# EasyEDA Pro project ProPrj_STM32 数控可调直流电源_2026-05-18.epro, board PCB1
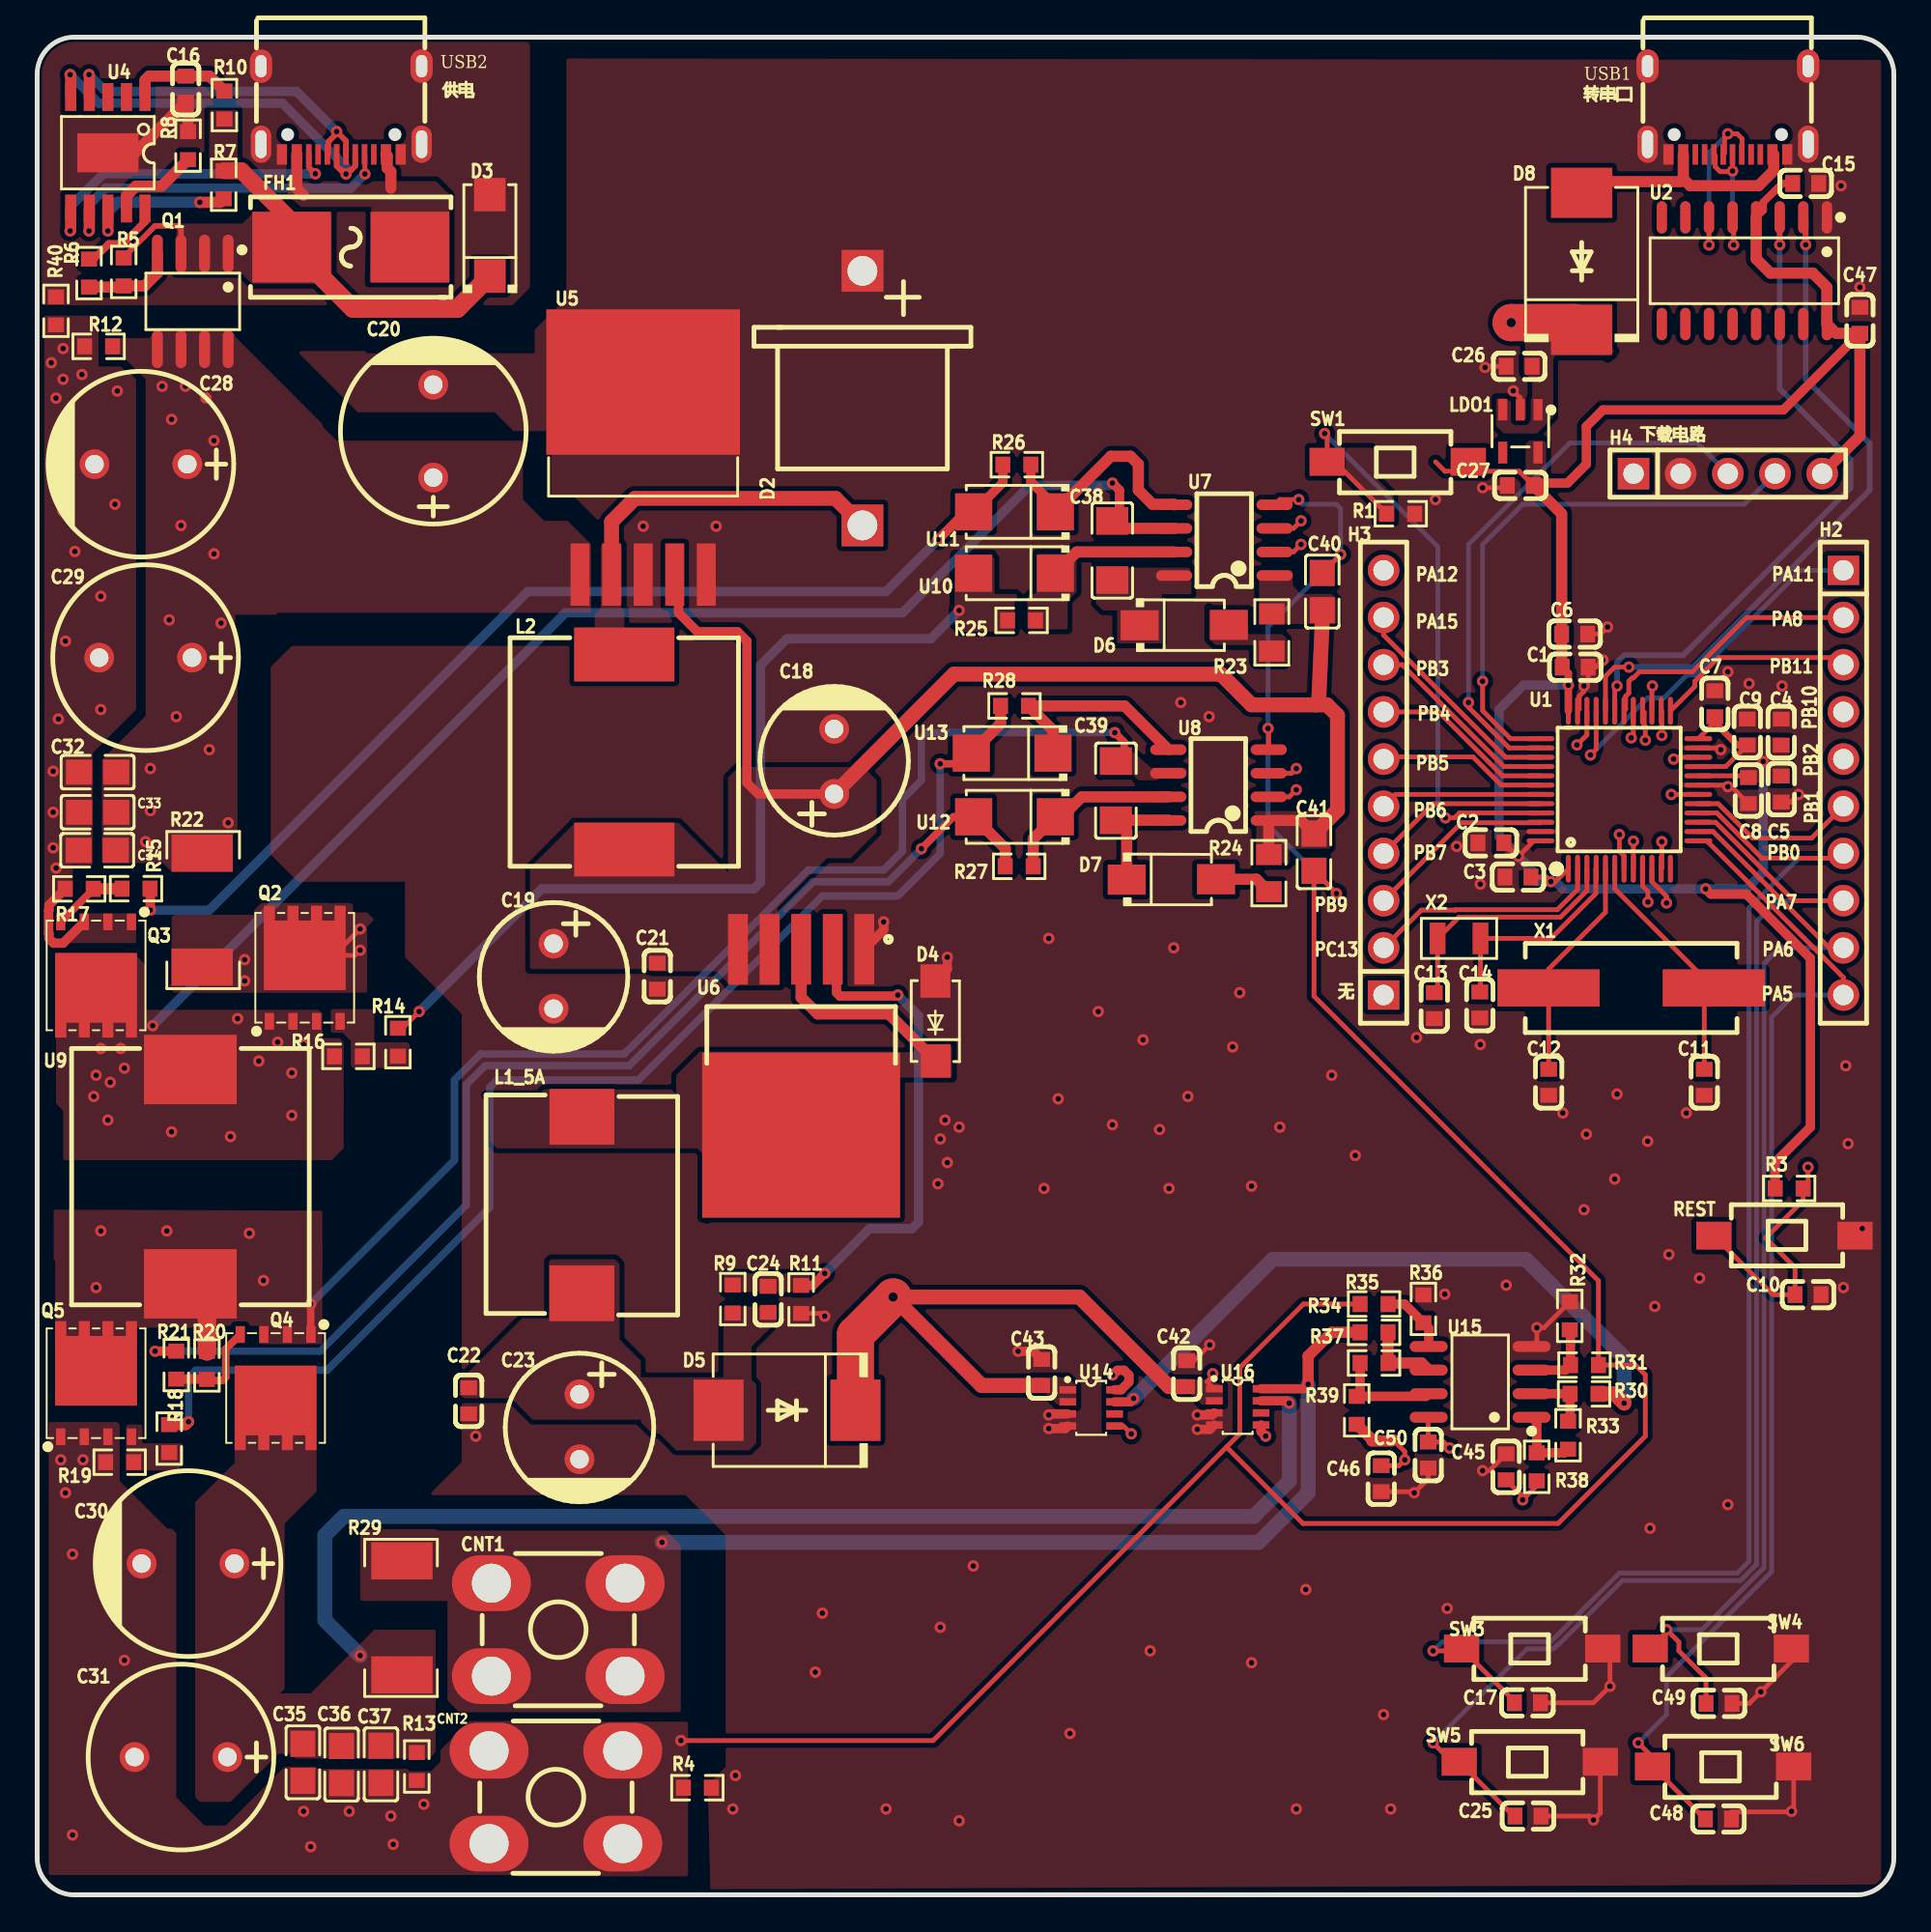
[diagram p2: board, top side]
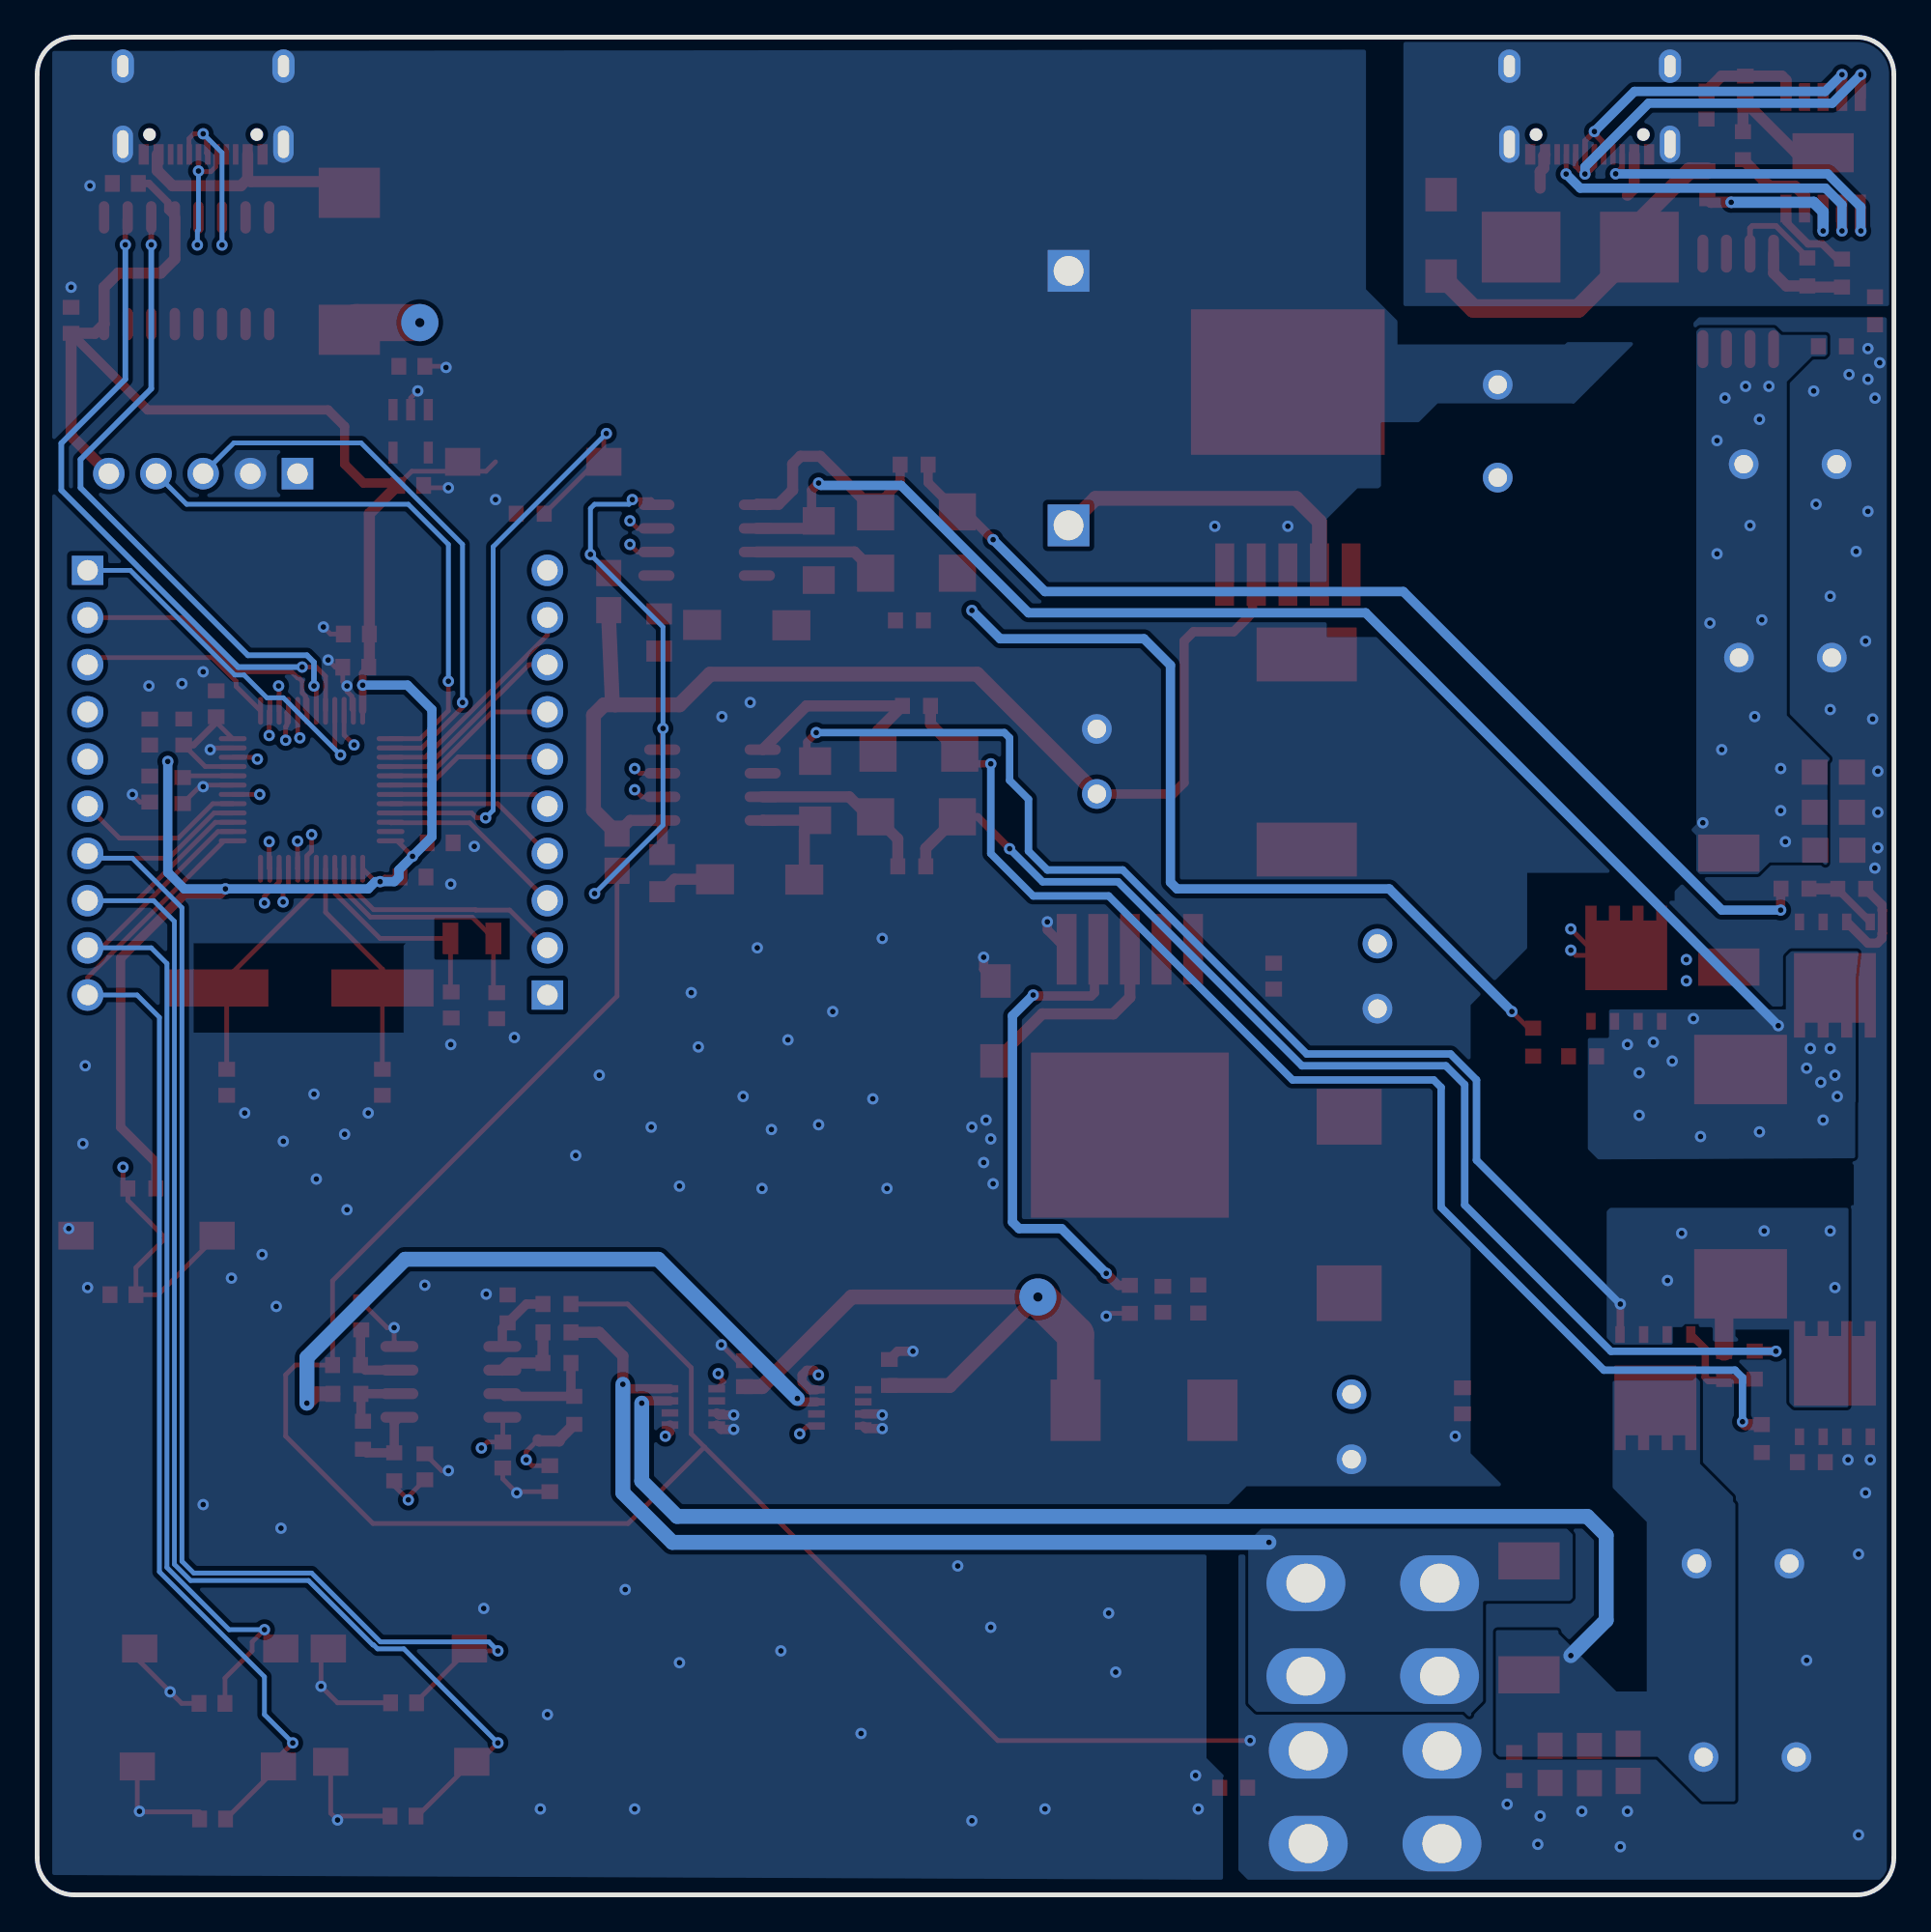
[diagram p3: board, bottom side, seen from below]

Outline 100 x 100 mm; copper layers: Top Layer, GND, POWER, Bottom Layer. Coordinates in mm from the lower left corner of the outline.
Outline path: 0,98 0,2 arc(0.59,0.59) 2,0 98,0 arc(99.41,0.59) 100,2 100,98 arc(99.41,99.41) 98,100 2,100 arc(0.59,99.41) 0,98
Stack: Top Layer 0.035mm Outer layer thickness 1oz / Dielectric1 0.2104mm 7628 RC49% 8.6mil / GND 0.0152mm Inner layer thickness / Dielectric2 1.065mm 1.1mm H/HOZ Copper / POWER 0.0152mm Inner layer thickness / Dielectric3 0.2104mm 7628 RC49% 8.6mil / Bottom Layer 0.035mm Outer layer thickness 1oz

## Design rules (mm)
spacing copperThickness1oz (default): track to track 0.12, other pairs 0.152 to 0.3
spacing copperThickness2oz: track to track 0.203, other pairs 0.152 to 0.3
track width copperThickness1oz (default): min 0.127, default 0.254, max 2.54
track width copperThickness2oz: min 0.203, default 0.254, max 2.54
differential pair differentialPair (default): width min 0.127, default 0.254, max 2.54; gap min 0.152, default 0.152

## Placement (name value [footprint] x y rotation side)
C1  100nF  [C0603]  82.84 66.08 180 top
C2  100nF  [C0603]  78.3 56.63 0 top
C3  100nF  [C0603]  79.76 54.79 0 top
C4  10nF  [C0603]  93.93 62.59 90 top
C5  1uF  [C0603]  93.94 59.52 270 top
C6  4.7uF  [C0603]  82.81 67.87 180 top
C7  100nF  [C0603]  90.36 64.11 270 top
C8  100nF  [C0603]  92.16 59.44 270 top
C9  1uF  [C0603]  92.11 62.59 90 top
C10  100nF  [C0603]  95.38 32.31 180 top
C11  30pF  [C0603]  89.79 43.74 90 top
C12  30pF  [C0603]  81.41 43.74 90 top
C13  15pF  [C0603]  75.25 47.86 90 top
C14  15pF  [C0603]  77.7 47.9 90 top
C15  100nF  [C0603]  95.25 92.13 180 top
C16  1uF  [C0603]  8 97.2 270 top
C17  10nF  [C0603]  80.26 10.34 0 top
C18  180uF  [CAP-TH_BD8.0-P3.50-D0.6-FD]  42.93 61.01 90 top
C19  220uF  [CAP-TH_BD8.0-P3.50-D0.5-FD]  27.81 49.45 270 top
C20  470uF  [CAP-TH_BD10.0-P5.00-D0.6-FD]  21.34 78.79 90 top
C21  1uF  [C0603]  33.4 49.45 270 top
C22  1uF  [C0603]  23.24 26.59 270 top
C23  330uF  [CAP-TH_BD8.0-P3.50-D0.5-FD]  29.21 25.2 270 top
C24  33nF  [C0603]  39.37 32.05 90 top
C25  10nF  [C0603]  80.3 4.24 0 top
C26  1uF  [C0603]  79.82 82.28 0 top
C27  1uF  [C0603]  79.88 75.87 0 top
C28  470uF  [CAP-TH_BD10.0-P5.00-D0.6-FD-A]  5.59 77.01 180 top
C29  220uF  [CAP-TH_BD10.0-P5.00-D0.6-FD_ERG50V220M10X13]  5.84 66.6 180 top
C30  470uF  [CAP-TH_BD10.0-P5.00-D0.6-FD-A]  8.13 17.83 180 top
C31  220uF  [CAP-TH_BD10.0-P5.00-D0.6-FD_ERG50V220M10X13]  7.75 7.42 180 top
C32  10uF  [C0805]  3.26 60.44 0 top
C33  10uF  [C0805]  3.26 58.28 0 top
C34  10uF  [C0805]  3.23 56.23 0 top
C35  10uF  [C0805]  14.31 7.13 90 top
C36  10uF  [C0805]  16.4 7.01 90 top
C37  10uF  [C0805]  18.52 7.02 90 top
C38  1uF  [C1206]  57.9 72.37 270 top
C39  1uF  [C1206]  58.1 59.44 270 top
C40  470nF  [C0805]  69.21 70.15 270 top
C41  470nF  [C0805]  68.77 56.13 90 top
C42  100nF  [C0603]  61.91 28.06 90 top
C43  100nF  [C0603]  54.1 28.12 90 top
C45  1nF  [C0603]  79.12 23.04 90 top
C46  1nF  [C0603]  72.39 22.4 270 top
C47  100nF  [C0603]  98.17 84.76 270 top
C48  10nF  [C0603]  90.55 4.08 0 top
C49  10nF  [C0603]  90.58 10.31 0 top
C50  100nF  [C0603]  74.92 23.68 270 top
CNT1  T34001  [CONN-TH_T34001]  28.07 14.27 90 top
CNT2  T34001  [CONN-TH_T34001]  27.94 5.26 90 top
D2  1N5825  [DIO-TH_BD11.4-L8.9-P13.7-RD]  44.45 80.57 90 top
D3  SMAJ24A  [SMA_L4.4-W2.6-LS5.0-RD]  24.38 89.33 90 top
D4  SS54  [SMA_L4.3-W2.6-LS5.0-FD]  48.39 47.04 270 top
D5  SS34  [SMC_L6.9-W5.9-LS7.9-RD]  40.39 26.09 180 top
D6  SS110  [SMA_L4.3-W2.6-LS5.0-RD]  61.78 68.35 0 top
D7  SS110  [SMA_L4.3-W2.6-LS5.0-RD]  61.09 54.66 0 top
D8  SS34  [SMC_L6.9-W5.9-LS7.9-RD]  83.18 87.93 90 top
FH1  XF-154  [FUSE-SMD_L10.5-W5.1]  16.89 88.7 180 top
H2  X5511FV-10-C70D30-1000  [HDR-TH_10P-P2.54-V-F]  97.28 59.87 270 top
H3  X5511FV-10-C70D30-1000  [HDR-TH_10P-P2.54-V-F]  72.52 59.87 90 top
H4  PZ254V-11-05P  [HDR-TH_5P-P2.54-V-M]  91.06 76.5 0 top
L1_5A  33uH  [IND-SMD_L11.5-W10.5]  29.34 37.13 90 top
L2  68uH  [IND-SMD_L12.3-W12.3_SMDRI127]  31.62 61.52 270 top
LDO1  ME6211C33M5G-N  [SOT-23-5_L3.0-W1.7-P0.95-LS2.8-BL]  79.88 78.79 180 top
Q1  AO4407A  [SOIC-8_L4.9-W3.9-P1.27-LS6.0-BL]  8.38 85.78 180 top
Q2  BSC027N06LS5ATMA1-MS  [TDSON-8_L5.9-W5.2-P1.27-BL-1]  14.41 48.8 0 top
Q3  BSC027N06LS5ATMA1-MS  [TDSON-8_L5.9-W5.2-P1.27-BL-1]  3.17 50.6 180 top
Q4  BSC027N06LS5ATMA1-MS  [TDSON-8_L5.9-W5.2-P1.27-BL-1]  12.84 28.39 180 top
Q5  BSC027N06LS5ATMA1-MS  [TDSON-8_L5.9-W5.2-P1.27-BL-1]  3.17 26.44 0 top
R1  10kΩ  [R0603]  73.44 74.35 180 top
R3  10kΩ  [R0603]  94.36 38.02 0 top
R4  0Ω  [R0603]  35.56 5.77 0 top
R5  10kΩ  [R0603]  4.66 87.36 270 top
R6  10kΩ  [R0603]  2.79 87.3 90 top
R7  10kΩ  [R0603]  10.05 92.05 270 top
R8  120kΩ  [R0603]  8.13 94.16 270 top
R9  16kΩ  [R0603]  37.46 32.07 270 top
R10  1kΩ  [R0603]  10.09 96.34 270 top
R11  3kΩ  [R0603]  41.15 32.05 90 top
R12  100kΩ  [R0603]  3.31 83.35 0 top
R13  10kΩ  [R0603]  20.45 6.91 90 top
R14  10Ω  [R0603]  19.43 45.9 270 top
R15  10Ω  [R0603]  5.33 54.16 180 top
R16  10kΩ  [R0603]  16.76 45.14 0 top
R17  10kΩ  [R0603]  2.27 54.15 0 top
R18  10Ω  [R0603]  7.11 24.56 270 top
R19  10kΩ  [R0603]  4.44 23.29 0 top
R20  10kΩ  [R0603]  9.14 28.5 270 top
R21  10Ω  [R0603]  7.49 28.52 90 top
R22  8mΩ  [RES-SMD_L6.4-W3.2-R2512]  8.89 53.01 270 top
R23  22Ω  [R0805]  66.5 67.95 90 top
R24  22Ω  [R0805]  66.34 55 90 top
R25  10Ω  [R0603]  53.02 68.6 180 top
R26  10Ω  [R0603]  52.77 76.99 180 top
R27  10Ω  [R0603]  52.89 55.36 180 top
R28  10Ω  [R0603]  52.64 64 180 top
R29  8mΩ  [RES-SMD_L6.4-W3.2-R2512]  19.65 14.91 90 top
R30  100kΩ  [R0603]  83.32 26.97 180 top
R31  100kΩ  [R0603]  83.34 28.52 180 top
R32  10kΩ  [R0603]  82.54 31.17 270 top
R33  10kΩ  [R0603]  82.45 24.74 90 top
R34  100kΩ  [R0603]  72 30.28 0 top
R35  100kΩ  [R0603]  72 31.8 0 top
R36  10kΩ  [R0603]  74.66 31.54 270 top
R37  10kΩ  [R0603]  72 28.63 0 top
R38  100Ω  [R0603]  80.77 23.04 270 top
R39  100Ω  [R0603]  71.07 26.08 270 top
R40  0Ω  [R0603]  1.02 85.27 270 top
REST  TS-1101-C-W  [SW-SMD_L6.0-W3.3-LS8.0]  94.11 35.48 180 top
SW1  TS-1101-C-W  [SW-SMD_L6.0-W3.3-LS8.0]  73.28 77.14 0 top
SW3  TS-1101-C-W  [SW-SMD_L6.0-W3.3-LS8.0]  80.52 13.26 0 top
SW4  TS-1101-C-W  [SW-SMD_L6.0-W3.3-LS8.0]  90.68 13.26 0 top
SW5  TS-1101-C-W  [SW-SMD_L6.0-W3.3-LS8.0]  80.39 7.16 0 top
SW6  TS-1101-C-W  [SW-SMD_L6.0-W3.3-LS8.0]  90.8 6.91 0 top
U1  STM32G474CBT6  [LQFP-48_L7.0-W7.0-P0.50-LS9.0-BL]  85.22 59.49 0 top
U2  CH340C  [SOP-16_L10.0-W3.9-P1.27-LS6.0-BL]  91.95 87.43 180 top
U4  CH224K  [ESSOP-10_L4.9-W3.9-P1.0-LS6.0-TL-EP]  3.81 93.78 180 top
U5  LM2596S-12/NOPB  [TO-263-5_L10.6-W9.6-P1.70-LS15.9-TL]  32.64 76.25 90 top
U6  XL4005E1  [TO-263-5_L10.2-W9.2-P1.70-TL]  41.15 45.9 270 top
U7  LM5109BMAX-JSM  [SOIC-8_L5.0-W4.0-P1.27-LS6.1-BL]  63.94 72.92 90 top
U8  LM5109BMAX-JSM  [SOIC-8_L5.0-W4.0-P1.27-LS6.1-BL]  63.63 59.74 90 top
U9  22uH  [IND-SMD_L13.8-W12.8]  8.25 38.66 270 top
U10  1N4007  [SMA_L4.3-W2.6-LS5.1-RD]  52.64 71.14 180 top
U11  1N4007  [SMA_L4.3-W2.6-LS5.1-RD]  52.64 74.45 180 top
U12  1N4007  [SMA_L4.3-W2.6-LS5.1-RD]  52.64 58.03 180 top
U13  1N4007  [SMA_L4.3-W2.6-LS5.1-RD]  52.51 61.46 180 top
U14  INA186A2IDDFR  [TSOT-23-8_L2.9-W1.6-P0.65-LS2.8-BL]  56.77 26.21 270 top
U15  GS8558-SR  [SOIC-8_L4.9-W3.8-P1.27-LS6.0-BL]  77.72 27.61 90 top
U16  INA186A2IDDFR  [TSOT-23-8_L2.9-W1.6-P0.65-LS2.8-BL]  64.66 26.27 270 top
USB1  TYPE-C 16PIN 2MD(073)  [USB-C-SMD_TYPE-C-6PIN-2MD-073]  91.06 96.06 180 top
USB2  TYPE-C 16PIN 2MD(073)  [USB-C-SMD_TYPE-C-6PIN-2MD-073]  16.38 96.06 180 top
X1  8MHz  [CRYSTAL-SMD_L11.5-W4.8-LS12.7]  85.85 48.82 0 top
X2  32.768kHz  [OSC-SMD_L3.2-W1.5]  76.58 51.49 0 top

## Footprints (pads in the part's own frame, mm; a bottom-side part is the same pattern mirrored in y, then rotated)
C0603
  rect 0.8x0.9 smd: 1(-0.7,0) 2(0.7,0)
C0805
  rect 1.41x1.35 smd: 1(-1,0) 2(1,0)
C1206
  rect 1.485x1.728 smd: 1(-1.593,0) 2(1.593,0)
CAP-TH_BD8.0-P3.50-D0.5-FD
  round 1.6 hole 1: 1(-1.75,0) 2(1.75,0)
CAP-TH_BD8.0-P3.50-D0.6-FD
  round 1.6 hole 1: 1(-1.75,0) 2(1.75,0)
CAP-TH_BD10.0-P5.00-D0.6-FD
  round 1.6 hole 1: 1(-2.5,0) 2(2.5,0)
CAP-TH_BD10.0-P5.00-D0.6-FD-A
  round 1.6 hole 1: 1(-2.5,0) 2(2.5,0)
CAP-TH_BD10.0-P5.00-D0.6-FD_ERG50V220M10X13
  round 1.6 hole 1: 1(-2.5,0) 2(2.5,0)
CONN-TH_T34001
  oval 3x4.25 hole 2.1: 1(-2.5,-3.6) 2(2.5,-3.6) 3(2.5,3.6) 4(-2.5,3.6)
CRYSTAL-SMD_L11.5-W4.8-LS12.7
  rect 5.5x2 smd: 1(-4.45,0) 2(4.45,0)
DIO-TH_BD11.4-L8.9-P13.7-RD
  rect 2.25x2.25 hole 1.6: 1(-6.85,0) 2(6.85,0)
ESSOP-10_L4.9-W3.9-P1.0-LS6.0-TL-EP
  rect 0.6x1.5 smd: 1(-2,-3) 2(-1,-3) 3(0,-3) 4(1,-3) 5(2,-3) 6(2,3) 7(1,3) 8(0,3) 9(-1,3) 10(-2,3)
  rect 3.3x2.1 smd: 11(0,0)
FUSE-SMD_L10.5-W5.1
  rect 4.24x3.81 smd: 1(-3.185,0) 2(3.185,0)
HDR-TH_5P-P2.54-V-M
  rect 1.7x1.7 hole 1.1: 1(-5.08,0)
  round 1.7 hole 1.1: 2(-2.54,0) 3(0,0) 4(2.54,0) 5(5.08,0)
HDR-TH_10P-P2.54-V-F
  rect 1.575x1.7 hole 1.1: 1(-11.43,0)
  round 1.7 hole 1.1: 2(-8.89,0) 3(-6.35,0) 4(-3.81,0) 5(-1.27,0) 6(1.27,0) 7(3.81,0) 8(6.35,0) 9(8.89,0) 10(11.43,0)
IND-SMD_L11.5-W10.5
  rect 3x3.5 smd: 1(-4.75,0) 2(4.75,0)
IND-SMD_L12.3-W12.3_SMDRI127
  rect 2.9x5.4 smd: 1(-5.25,0) 2(5.25,0)
IND-SMD_L13.8-W12.8
  rect 3.735x5 smd: 1(-5.768,0) 2(5.768,0)
LQFP-48_L7.0-W7.0-P0.50-LS9.0-BL
  oval 0.27x1.5 smd: 1(-2.75,-4.25) 2(-2.25,-4.25) 3(-1.75,-4.25) 4(-1.25,-4.25) 5(-0.75,-4.25) 6(-0.25,-4.25) 7(0.25,-4.25) 8(0.75,-4.25) 9(1.25,-4.25) 10(1.75,-4.25) 11(2.25,-4.25) 12(2.75,-4.25) 25(2.75,4.25) 26(2.25,4.25) 27(1.75,4.25) 28(1.25,4.25) 29(0.75,4.25) 30(0.25,4.25) 31(-0.25,4.25) 32(-0.75,4.25) 33(-1.25,4.25) 34(-1.75,4.25) 35(-2.25,4.25) 36(-2.75,4.25)
  oval 1.5x0.27 smd: 13(4.25,-2.75) 14(4.25,-2.25) 15(4.25,-1.75) 16(4.25,-1.25) 17(4.25,-0.75) 18(4.25,-0.25) 19(4.25,0.25) 20(4.25,0.75) 21(4.25,1.25) 22(4.25,1.75) 23(4.25,2.25) 24(4.25,2.75) 37(-4.25,2.75) 38(-4.25,2.25) 39(-4.25,1.75) 40(-4.25,1.25) 41(-4.25,0.75) 42(-4.25,0.25) 43(-4.25,-0.25) 44(-4.25,-0.75) 45(-4.25,-1.25) 46(-4.25,-1.75) 47(-4.25,-2.25) 48(-4.25,-2.75)
OSC-SMD_L3.2-W1.5
  rect 0.85x1.7 smd: 1(-1.155,0) 2(1.155,0)
R0603
  rect 0.806x0.864 smd: 1(-0.753,0) 2(0.753,0)
R0805
  rect 1.133x1.377 smd: 1(-1,0) 2(1,0)
RES-SMD_L6.4-W3.2-R2512
  rect 2x3.3 smd: 1(-3.067,0) 2(3.067,0)
SMA_L4.3-W2.6-LS5.0-FD
  rect 1.8x1.62 smd: 1(-2.15,-0.009) 2(2.15,0.009)
SMA_L4.3-W2.6-LS5.0-RD
  rect 2.046x1.62 smd: 1(-2.404,-0.009) 2(2.404,0.009)
SMA_L4.3-W2.6-LS5.1-RD
  rect 2x2 smd: 1(-2.2,0) 2(2.2,0)
SMA_L4.4-W2.6-LS5.0-RD
  rect 1.8x1.7 smd: 1(-2.192,0) 2(2.192,0)
SMC_L6.9-W5.9-LS7.9-RD
  rect 2.7x3.3 smd: 1(-3.687,0) 2(3.687,0)
SOIC-8_L4.9-W3.8-P1.27-LS6.0-BL
  oval 0.588x2.045 smd: 1(-1.905,-2.772) 2(-0.635,-2.772) 3(0.635,-2.772) 4(1.905,-2.772) 5(1.905,2.772) 6(0.635,2.772) 7(-0.635,2.772) 8(-1.905,2.772)
SOIC-8_L4.9-W3.9-P1.27-LS6.0-BL
  oval 0.588x2.045 smd: 1(-1.905,-2.57) 2(-0.635,-2.57) 3(0.635,-2.57) 4(1.905,-2.57) 5(1.905,2.57) 6(0.635,2.57) 7(-0.635,2.57) 8(-1.905,2.57)
SOIC-8_L5.0-W4.0-P1.27-LS6.1-BL
  oval 0.569x1.95 smd: 1(-1.905,-2.705) 2(-0.635,-2.705) 3(0.635,-2.705) 4(1.905,-2.705) 5(1.905,2.705) 6(0.635,2.705) 7(-0.635,2.705) 8(-1.905,2.705)
SOP-16_L10.0-W3.9-P1.27-LS6.0-BL
  oval 0.56x1.745 smd: 1(-4.445,-2.873) 2(-3.175,-2.873) 3(-1.905,-2.873) 4(-0.635,-2.873) 5(0.635,-2.873) 6(1.905,-2.873) 7(3.175,-2.873) 8(4.445,-2.873) 9(4.445,2.873) 10(3.175,2.873) 11(1.905,2.873) 12(0.635,2.873) 13(-0.635,2.873) 14(-1.905,2.873) 15(-3.175,2.873) 16(-4.445,2.873)
SOT-23-5_L3.0-W1.7-P0.95-LS2.8-BL
  rect 0.49x1.157 smd: 1(-0.95,-1.153) 2(0,-1.153) 3(0.95,-1.153)
  rect 0.49x1.175 smd: 4(0.95,1.153) 5(-0.95,1.153)
SW-SMD_L6.0-W3.3-LS8.0
  rect 1.9x1.5 smd: 1(-3.8,0) 2(3.8,0)
TDSON-8_L5.9-W5.2-P1.27-BL-1
  rect 0.5x0.9 smd: 1(-1.905,-1.775) 2(-0.635,-1.775) 3(0.635,-1.775) 4(1.905,-1.775)
  custom 4.41x4.55 smd: 5(0,1.775)
TO-263-5_L10.2-W9.2-P1.70-TL
  rect 3.8x1.069 smd: 1(-5.003,3.404) 2(-5.003,1.702) 3(-5.003,0) 4(-5.003,-1.702) 5(-5.003,-3.404)
  rect 8.89x10.66 smd: 6(5.003,0)
TO-263-5_L10.6-W9.6-P1.70-LS15.9-TL
  rect 3.358x1.02 smd: 1(-5.184,3.4) 2(-5.184,1.7) 3(-5.184,0) 4(-5.184,-1.7) 5(-5.184,-3.4)
  rect 7.83x10.431 smd: 6(5.183,0)
TSOT-23-8_L2.9-W1.6-P0.65-LS2.8-BL
  rect 0.4x0.9 smd: 1(-0.975,-1.26) 2(-0.325,-1.26) 3(0.325,-1.26) 4(0.975,-1.26) 5(0.975,1.26) 6(0.325,1.26) 7(-0.325,1.26) 8(-0.975,1.26)
USB-C-SMD_TYPE-C-6PIN-2MD-073
  rect 0.55x1.1 smd: 1(-3.2,2.375) 2(-2.4,2.375) 11(2.4,2.375) 12(3.2,2.375)
  rect 0.3x1.1 smd: 3(-1.75,2.375) 4(-1.25,2.375) 5(-0.75,2.375) 6(-0.25,2.375) 7(0.25,2.375) 8(0.75,2.375) 9(1.25,2.375) 10(1.75,2.375)
  oval 1.1x2 hole 0.6x1.5: 13(-4.325,1.825) 14(4.325,1.825)
  oval 1.2x1.8 hole 0.6x1.2: 13(-4.325,-2.375) 14(4.325,-2.375)

## Nets
As in the schematic.

Pads without a net: LDO1 4; U1 12; U2 7 8 9 10 11 12 13 14 15; U4 2 3; U14 6; U16 6; USB1 3 4 9 10; USB2 3 9

## Via types
v1: diameter 0.61, hole 0.305, Top Layer to Bottom Layer, 244 vias
v2: diameter 2, hole 0.5, Top Layer to Bottom Layer, 2 vias

## Routing (per net, layer and track width the routed paths; a pad name or vN(x,y) marks a point on that pad's centre or on a via; arc(x,y) is an arc through that point)
GND: length 57.5
  Top Layer w0.254: v1(90.68,61.65) 90.59,61.74 U1.23 ; C8.2 91.26,59.65 v1(91.06,59.65) 90.97,59.74 U1.19 ; R11.1 42.27,31.3 v1(42.42,31.15) ; v1(84.58,68.25) 84.2,67.87 C6.1 ; C5.2 94.46,58.82 v1(94.87,59.23) ; C46.2 74.11,21.7 v1(74.17,21.64) 74.92,22.39 C50.2 ; C25.2 83.61,4.24 v1(83.82,4.03) 84.19,4.4 84.19,7.16 ; v1(77.98,82.22) 78.04,82.28 C26.1 ; v1(63.15,29.61) 62.3,28.76 61.91,28.76 ; C17.2 83.82,10.34 v1(84.71,11.23) 84.71,12.87 SW3.2 ; C45.2 78.21,22.83 v1(77.85,22.83) ; v1(79.5,80.96) 79.88,80.57 LDO1.2 ; U1.35 83.05,63.82 83.05,64.52 83.31,64.78 v1(83.31,65.07) 83.54,65.3 C1.1 83.94,66.08 v1(84.33,66.47) ; SW4.2 94.48,12.57 v1(92.84,10.93) 92.22,10.31 C49.2 ; U15.4 80.77,29.8 v1(80.77,30.53) 81.15,30.53 R32.1 ; C27.1 79.06,75.74 v1(77.85,75.74) ; SW6.2 94.61,4.61 v1(94.49,4.5) 94.46,4.47 91.25,4.47
  Top Layer w0.5: v1(52.83,29.26) 53.66,29.26 C43.2 ; v1(62.48,25.06) 63.16,25.06 U16.4 ; U6.1 45.59,51.94 v1(45.59,52.37) ; U14.4 55.37,25.1 v1(54.48,25.1) ; 63.4,25.94 63.29,25.83 v1(62.48,25.83) ; D4.1 49.02,49.84 v1(49.02,50.47) ; U14.3 54.54,25.89 v1(54.48,25.83)
  vias: v1(23.62,24.69) v1(32.64,73.67) v1(36.57,73.67) v1(37.46,4.62) v1(37.61,6.43) v1(41.91,11.99) v1(42.29,15.16) v1(45.72,4.62) v1(48.51,38.28) v1(48.64,40.69) v1(48.64,14.4) v1(48.89,41.71) v1(49.02,39.42) v1(49.66,41.33) v1(49.66,3.99) v1(50.42,17.7) v1(54.23,38.02) v1(54.48,51.49) v1(54.99,42.85) v1(55.63,8.69) v1(57.15,47.55) v1(57.91,41.45) v1(59.56,46.02) v1(59.94,13.13) v1(60.45,41.2) v1(60.96,38.02) v1(61.21,50.98) v1(61.59,64.19) v1(61.98,42.98) v1(63.12,63.42) v1(64.39,45.64) v1(64.77,48.56) v1(65.4,38.15) v1(65.4,12.5) v1(66.93,41.33) v1(67.82,4.62) v1(68.33,16.43) v1(69.72,44.12) v1(70.99,39.8) v1(72.52,9.7) v1(72.9,4.62) v1(74.3,46.15) v1(75.31,75.11) v1(75.81,32.34) v1(75.95,15.42) v1(76.45,56.44) v1(77.72,54.41) v1(77.72,45.77) v1(79.12,32.82) v1(82.17,42.09) v1(83.31,36.88) v1(83.44,40.94) v1(84.96,38.53) v1(85.09,43.1) v1(86.74,40.56) v1(86.87,19.74) v1(87.12,31.67) v1(87.88,34.47) v1(88.82,42.09) v1(89.53,33.2) v1(91.06,65.84) v1(91.06,21.01) v1(92.2,65.2) v1(93.98,65.07) v1(97.15,92) v1(97.28,32.69) v1(97.41,44.63) v1(97.54,40.44) v1(98.17,86.54) v1(98.3,35.86)
PGND: length 151.2
  Top Layer w0.254: v1(70.2,72.16) 70.2,72.14 C40.1 ; R35.1 68.2,31.8 64.77,28.37 64.77,24.82 64.06,24.1 ; v1(69.98,53.9) 69.98,53.92 C41.1 68.77,48.38 84.09,33.05 R31.1 86.09,28.52 86.61,27.99 86.61,24.69 81.92,19.99 68.17,19.99 64.06,24.1 ; U8.4 66.33,62.75 v1(66.29,62.79) ; v1(34.67,8.31) 48.26,8.31 64.06,24.1 ; v1(67.94,75.11) 66.93,75.11 66.65,74.83
  Top Layer w0.5: 1.52,54.15 0.63,53.27 0.63,53.01 0.62,52.99 0.62,51.76 0.63,51.74 0.63,51.49 0.89,51.23 1.4,51.23 Q3.3
  Bottom Layer w0.254: v1(67.94,75.11) 67.94,75.03 68.12,74.85 69.98,74.85 70.2,74.63 v1(70.2,72.16) 66.29,68.25 v1(66.29,62.79) 66.29,57.58 v1(69.98,53.9)
  vias: v1(0.76,82.47) v1(0.86,60.48) v1(0.86,58.28) v1(0.86,56.36) v1(1.02,80.57) v1(1.02,55.27) v1(1.14,63.3) v1(1.27,23.42) v1(1.4,83.24) v1(1.4,81.58) v1(1.4,74.47) v1(1.52,67.49) v1(1.52,21.64) v1(1.9,18.34) v1(1.9,3.23) v1(2.03,72.31) v1(2.41,81.84) v1(2.47,23.42) v1(3.43,69.9) v1(3.43,63.8) v1(4.19,74.85) v1(4.32,80.95) v1(4.7,12.62) v1(14.35,4.5) v1(14.73,2.59) v1(16.81,4.5) v1(19.05,4.24) v1(19.18,2.72) v1(20.83,4.88)
VBUS: length 24.2
  Top Layer w0.3: R5.1 4.66,88.15 6.35,89.84 7.62,89.84 7.75,89.71 Q1.3
  Top Layer w0.9: R7.1 11,92.81 13.71,90.1 FH1.2
  Top Layer w1: D3.1 22.64,85.39 17.01,85.39 FH1.2
VCC5: length 137.9
  Top Layer w0.254: U16.1 63.01,27.63 63.32,27.94 v1(63.32,28.06) ; v1(76.07,24.05) 75.75,24.38 C50.1 74.92,25.68 U15.8
  Top Layer w0.8: 54.1,27.42 50.86,27.42 v2(46.1,32.18) 56.13,32.18 60.96,27.36 C42.1
  Top Layer w2: D5.1 44.07,30.15 v2(46.1,32.18) ; v2(79.39,84.63) 82.8,84.63 D8.1
  POWER w0.254: v1(63.32,28.06) 63.32,25.89 65.15,24.05 v1(76.07,24.05)
  POWER w2: v2(79.39,84.63) 56.26,84.63 51.69,80.06 51.69,37.77 v2(46.1,32.18)
VCC12: length 66.2
  Top Layer w0.5: U5.4 34.54,70.86 34.54,69.01 35.56,68 37.72,68 38.23,67.49 38.23,59.87 38.83,59.26 C18.1
  Top Layer w0.6: R24.2 66.33,56.01 U8.1 68.06,57.84 C41.2
  Top Layer w0.8: 68.87,64.06 65.4,64.06 63.75,65.71 49.37,65.71 C18.1 ; 68.87,64.06 69.02,64.21 69.23,69.05 ; 68.87,64.06 69.47,64.06 70.03,63.49 70.03,58.39 C41.2
VCC20: length 115.4
  Top Layer w0.5: v1(59.05,26.72) 58.87,26.54 U14.7
  Top Layer w0.8: 84.07,26.97 84.97,26.97 v1(85.47,26.47)
  POWER w0.8: v1(10.29,57.71) 18.03,57.71 22.22,53.52 22.22,30.77 22.79,30.21 59.8,30.21 60.36,29.64 60.36,28.84 59.05,27.53 v1(59.05,26.72)
  Bottom Layer w0.8: v1(59.05,26.72) 66.55,34.21 80.18,34.21 85.47,28.92 v1(85.47,26.47)
  vias: v1(5.84,56.69) v1(6.1,60.63) v1(6.1,58.36) v1(6.73,81.2) v1(7.11,68.63) v1(7.24,79.43) v1(7.49,63.42) v1(7.75,73.71) v1(7.99,81.2) v1(9.1,80.58) v1(9.27,61.65) v1(9.52,78.28) v1(9.52,72.19) v1(9.91,68.46)
VCC20_PWR: length 72.6
  Top Layer w0.254: 15.98,50.57 v1(17.4,51.99) ; 15.98,50.57 17.12,50.57 v1(17.4,50.85) ; 15.98,50.57 Q2.5
  Top Layer w0.5: v1(57.92,27.98) 58.17,28.24 58.54,28.24 58.8,27.98 58.8,27.61 58.38,27.19 U14.8
  POWER w0.8: v1(11.18,49.2) 17.53,49.2 20.78,45.95 20.78,29.69 22.1,28.37 57.53,28.37 v1(57.92,27.98)
  vias: v1(11.18,50.34)
VCC33: length 131
  Top Layer w0.254: 75.31,77.14 75.82,76.63 79.82,76.63 C27.2 ; U1.21 90.95,60.74 C9.1 ; U1.20 92.07,60.24 C8.1 ; C3.2 81.28,54.79 v1(81.53,54.54) 81.77,54.54 U1.1 ; U1.48 80.61,56.74 v1(79.78,55.9) 79.72,55.9 79,56.63 ; 90.36,63.13 U1.24
  Top Layer w0.35: C9.1 91.57,61.89 90.36,63.11 C7.2
  Top Layer w0.4: U1.36 v1(82.47,65.12) 82.47,65.76 C1.2 ; U2.4 92.96,90.68 92.96,91.11 93.98,92.13 C15.2
  Top Layer w0.5: R3.1 93.61,39.43 95.5,41.33 95.5,50.41 92.05,53.87 90.14,53.87 v1(89.86,54.15) ; C27.2 80.71,76 82.42,76 83.44,77.01 83.44,79.04 84.33,79.93 94.05,79.93 C47.2
  Top Layer w0.6: C1.2 82.11,66.12 82.11,74.35 C27.2 ; H4.5 98.17,78.54 C47.2 96.89,84.06 U2.16 96.39,86.54 95.63,87.3 93.34,87.3 92.58,88.06 U2.4
  Bottom Layer w0.5: v1(82.47,65.12) 80.05,65.12 78.74,63.8 78.74,56.95 v1(79.78,55.9) 80.52,55.17 80.52,54.79 80.77,54.54 81.78,54.54 82.17,54.15 v1(89.86,54.15) 92.08,54.15 92.96,55.04 v1(92.96,61.01)
VIN-: length 7
  Top Layer w0.6: U4.11 5.27,93.78 C16.2 8.13,96.38 R8.1
ADC_I_OUT: length 62
  Top Layer w0.254: v1(86.75,53.45) 86.75,54.01 86.47,54.3 U1.9
  Top Layer w0.5: v1(66.17,24.69) 65.92,24.94 U16.5
  POWER w0.254: v1(86.75,53.45) 86.88,53.45 87.52,52.81 91.72,52.81 93.81,50.72 93.81,28.94 89.55,24.69 v1(66.17,24.69)
ADC_I_PWR: length 70.1
  Top Layer w0.254: U14.5 58.51,25.24 v1(58.93,24.82) ; v1(85.97,56.72) 85.97,55.24 U1.8
  POWER w0.254: v1(85.97,56.72) 85.98,56.71 85.98,53.39 86.97,52.4 91.56,52.4 93.4,50.56 93.4,32.62 89.66,28.88 62.99,28.88 v1(58.93,24.82)
ADC_V_IN: length 54
  Top Layer w0.254: C45.1 80.01,21.45 v1(80.01,21.26) 80.77,22.02 R38.2 ; U1.11 87.5,55.27 v1(87.5,56.69)
  POWER w0.254: v1(87.5,56.69) 89.15,56.69 94.61,51.23 94.61,28.5 87.38,21.26 v1(80.01,21.26)
ADC_V_OUT: length 59.9
  Top Layer w0.254: 73.02,24.5 73.66,23.86 v1(73.66,23.42) 73.34,23.1 C46.1 ; v1(87.76,53.39) 87.76,53.75 86.97,54.54 U1.10
  Top Layer w0.6: 73.02,24.5 72.95,24.44 71.88,24.44 71.88,24.52 R39.2
  POWER w0.254: v1(73.66,23.42) 88.96,23.42 94.21,28.67 94.21,51.06 91.88,53.39 v1(87.76,53.39)
CH224K_CC1: length 19.2
  Top Layer w0.254: v1(17.65,92.63) 17.65,93.67 USB2.4
  Top Layer w0.6: v1(2.79,89.57) 2.81,89.59 U4.7
  Bottom Layer w0.5: v1(17.65,92.63) 16.89,91.87 3.68,91.87 2.79,90.98 v1(2.79,89.57)
CH224K_CC2: length 17.6
  Top Layer w0.3: USB2.10 14.63,92.99 v1(14.98,92.64)
  Top Layer w0.6: v1(1.78,89.57) 1.81,89.6 U4.6
  Bottom Layer w0.5: v1(14.98,92.64) 3.57,92.64 1.78,90.86 v1(1.78,89.57)
CH224K_DM: length 21.1
  Top Layer w0.3: USB2.7 16.13,93.06 16.36,92.84 16.43,92.84 v1(16.64,92.63) 16.84,92.84 16.91,92.84 17.13,93.06 USB2.5
  Top Layer w0.6: v1(1.78,97.98) 1.81,97.95 U4.5
  Bottom Layer w0.5: v1(1.78,97.98) 3.32,96.44 13.21,96.44 16.64,93.01 v1(16.64,92.63)
CH224K_DP: length 18.7
  Top Layer w0.3: USB2.8 15.68,93.74 15.68,94.36 16.13,94.81 v1(16.13,94.92) 16.63,94.42 USB2.6
  Top Layer w0.6: v1(2.79,97.98) 2.81,97.97 U4.4
  Bottom Layer w0.5: v1(2.79,97.98) 3.7,97.08 13.97,97.08 v1(16.13,94.92)
CH224K_PG: length 4.6
  Top Layer w0.4: U4.10 5.81,90.06 4.62,88.87 3.86,88.87 3.04,88.05 R6.2
CH340C_RXD: length 35.3
  Top Layer w0.254: v1(85.09,65.07) 84.97,64.95 U1.31
  Top Layer w0.3: U2.3 v1(93.85,88.82)
  Bottom Layer w0.3: v1(85.09,65.07) 85.09,66.34 85.47,66.73 88.65,66.73 97.66,75.74 97.66,77.27 93.85,81.08 v1(93.85,88.82)
CH340C_TXD: length 36.4
  Top Layer w0.254: v1(85.72,66.09) 84.96,66.09 84.47,65.59 U1.32
  Top Layer w0.3: U2.2 95.25,90.17 v1(95.25,88.82)
  Bottom Layer w0.3: v1(95.25,88.82) 95.25,81.58 98.7,78.14 98.7,75.62 89.17,66.09 v1(85.72,66.09)
D+: length 8.2
  Top Layer w0.254: USB1.6 91.31,93.69 v1(91.31,92.79) 91.28,92.76 90.64,92.76 90.38,93.02 90.38,93.62 USB1.8 ; U2.5 91.37,90.24 v1(91.37,88.81)
  Bottom Layer w0.254: v1(91.37,88.81) 91.37,89.56 91.31,89.62 91.31,92.79 v1(91.31,92.79)
D-: length 10.8
  Top Layer w0.254: USB1.5 91.82,93.7 91.82,94.54 91.56,94.8 v1(91.06,94.8) 90.88,94.62 90.88,93.76 USB1.7 ; v1(90.04,88.81) U2.6
  Bottom Layer w0.254: v1(91.06,94.8) 90.04,93.78 v1(90.04,88.81)
JTCK/SWCLK: length 30.5
  Top Layer w0.254: U1.38 79.28,61.74 77.09,63.93 v1(77.09,64.19)
  Bottom Layer w0.254: H4.3 89.41,78.16 82.55,78.16 77.09,72.69 v1(77.09,64.19)
JTMS/SWDIO: length 30
  Top Layer w0.254: v1(77.85,65.33) 77.85,63.74 79.36,62.24 U1.37
  Bottom Layer w0.254: H4.4 91.95,74.85 80.01,74.85 77.85,72.69 v1(77.85,65.33)
MCU_PWM_H1: length 27.7
  Top Layer w0.254: 66.65,72.29 67.66,72.29 v1(68.07,72.69) ; U1.26 87.5,63.7 v1(87.5,62.41)
  POWER w0.254: v1(87.5,62.41) 87.19,62.41 86.86,62.74 86.5,62.74 83.02,66.22 81.03,66.22 73.28,73.96 71.12,73.96 69.85,72.69 v1(68.07,72.69)
MCU_PWM_H2: length 38.3
  Top Layer w0.254: v1(67.82,59.49) 67.44,59.11 U8.2 ; U1.28 86.55,63.65 86.55,62.95 86.61,62.89 v1(86.61,62.15)
  POWER w0.254: v1(67.82,59.49) 71.37,63.04 71.37,72.82 71.55,73 72.85,73 84.15,61.7 86.09,61.7 86.55,62.15 v1(86.61,62.15)
MCU_PWM_L1: length 27.1
  Top Layer w0.254: v1(68.07,73.96) 67.66,73.56 66.65,73.56 ; U1.27 86.97,65.05 v1(86.99,65.07)
  POWER w0.254: v1(68.07,73.96) 68.48,74.37 73.51,74.37 80.39,67.49 86.61,67.49 86.79,67.31 86.79,65.28 v1(86.99,65.07)
MCU_PWM_L2: length 36.6
  Top Layer w0.254: U1.29 85.97,62.4 v1(85.85,62.28) ; U8.3 67.56,60.38 v1(67.82,60.63)
  POWER w0.254: v1(85.85,62.28) 84.33,62.28 73.15,73.46 71.25,73.46 70.87,73.08 70.87,63.68 v1(67.82,60.63)
MOS_PWM_H1: length 46.4
  Top Layer w0.254: R14.1 19.68,46.65 v1(20.57,47.55)
  Bottom Layer w0.5: v1(20.57,47.55) 27.18,54.15 38.61,54.15 38.96,54.51 38.96,66.19 40.39,67.61 48.13,67.61 v1(49.66,69.14)
MOS_PWM_H2: length 64.3
  Top Layer w0.4: U12.2 49.34,58.03 v1(47.62,56.31)
  Top Layer w0.5: R21.2 6.36,29.27 v1(6.35,29.26)
  Top Layer w0.6: R27.2 52.14,56.33 U12.2
  Bottom Layer w0.4: v1(47.62,56.31) 45.85,54.53 41.78,54.53 31.88,44.63 24.13,44.63 23.11,43.61 23.11,37.13 15.24,29.26 v1(6.35,29.26)
MOS_PWM_L1: length 57.6
  Top Layer w0.5: v1(6.1,53.01) 6.1,54.14 R15.1 ; 52.01,76.99 52.01,76.02 U11.2 50.01,74.45 v1(48.51,72.95)
  Bottom Layer w0.5: v1(48.51,72.95) 45.72,70.15 26.42,70.15 9.27,53.01 v1(6.1,53.01)
MOS_PWM_L2: length 69.4
  Top Layer w0.4: v1(48.64,60.88) 49.74,60.88 U13.2
  Top Layer w0.6: R28.2 51.89,63.03 U13.2 ; v1(8.15,25.47) 8,25.32 R18.1
  Bottom Layer w0.4: v1(48.64,60.88) 48.64,56.06 46.36,53.77 42.29,53.77 32.39,43.87 24.78,43.87 24.38,43.47 24.38,37.01 15.62,28.25 8.55,28.25 8.15,27.84 v1(8.15,25.47)
PA5: length 63.8
  Top Layer w0.254: 89.85,4.08 89.83,4.08 SW6.1 87,7.41 v1(86.23,8.18) ; H2.10 97.28,49.38 89.93,56.74 U1.13
  Bottom Layer w0.254: v1(86.23,8.18) 87.76,9.7 87.76,11.73 93.41,17.39 93.41,47.24 94.61,48.44 H2.10
PA6: length 60.4
  Top Layer w0.254: U1.14 90.26,57.24 96.52,50.98 H2.9 ; 86.89,13.27 87.76,14.14 v1(87.76,14.27) 88.42,13.61 88.42,13.13 89.88,11.67 C49.1
  Bottom Layer w0.254: H2.9 93.85,50.98 93.01,50.13 93.01,17.62 89.66,14.27 v1(87.76,14.27)
PA7: length 76.8
  Top Layer w0.254: U1.15 90.4,57.74 94.61,53.52 97.28,53.52 ; 79.59,4.24 79.51,4.24 SW5.1 76.2,7.16 v1(75.18,8.18)
  Bottom Layer w0.254: 97.28,53.52 93.73,53.52 92.61,52.4 92.61,17.79 91.73,16.92 85.38,16.92 81.92,13.45 81.87,13.45 81.67,13.24 80.25,13.24 v1(75.18,8.18)
PA8: length 14.7
  Top Layer w0.254: H2.2 92.08,68.76 89.15,65.84 86.3,65.84 85.97,65.51 85.9,65.51 85.72,65.33 85.72,64.7 85.55,64.52 85.55,63.82 U1.30
PA11: length 20.2
  Top Layer w0.254: v1(83.66,61.36) 83.97,61.67 U1.33
  Bottom Layer w0.254: 97.28,71.3 94.98,71.3 89.35,65.66 88.85,65.66 87.63,64.44 86.74,64.44 v1(83.66,61.36)
PA12: length 16.4
  Top Layer w0.254: v1(82.93,61.9) 83.47,62.44 U1.34
  POWER w0.254: v1(82.93,61.9) 73.53,71.3 72.52,71.3
PA15: length 12.1
  Top Layer w0.254: H3.9 72.52,67.81 79.09,61.24 U1.39
PB0: length 75.2
  Top Layer w0.254: SW3.1 76.84,13.13 ; 76.84,13.13 79.56,10.41 C17.1 ; 76.84,13.13 v1(75.18,13.13) ; H2.7 97.03,55.8 92.9,55.8 90.47,58.24 U1.16
  Bottom Layer w0.254: H2.7 97.03,55.8 94.87,55.8 92.2,53.14 92.2,17.96 91.57,17.32 85.22,17.32 81.51,13.62 75.67,13.62 v1(75.18,13.13)
PB1: length 9.3
  Top Layer w0.254: U1.17 90.54,58.74 92.39,56.88 95.57,56.88 97.28,58.6
PB2: length 11.9
  Top Layer w0.254: U1.18 88.02,59.24 v1(88.01,59.23)
  POWER w0.254: H2.5 95.25,61.14 92.84,58.72 91.06,58.72 90.55,59.23 v1(88.01,59.23)
PB3: length 10.7
  Top Layer w0.254: H3.8 73.51,66.22 78.99,60.74 U1.40
PB4: length 9.9
  Top Layer w0.254: U1.41 78.92,60.24 75.48,63.68 H3.7
PB5: length 9.1
  Top Layer w0.254: U1.42 80.96,59.74 78.85,59.74 77.33,61.25 72.63,61.25 H3.6
PB6: length 8.7
  Top Layer w0.254: 72.52,58.6 73.16,59.24 U1.43
PB7: length 9.6
  Top Layer w0.254: H3.4 75.2,58.74 U1.44
PB8-BOOT0: length 34.6
  Top Layer w0.254: U1.45 76.6,58.24 76.34,57.97 v1(75.85,57.97) ; v1(69.34,78.66) 69.48,78.53 SW1.1 69.89,77.14 R1.2
  Bottom Layer w0.254: v1(75.85,57.97) 75.44,58.38 75.44,72.57 v1(69.34,78.66)
PB9: length 10.2
  Top Layer w0.254: U1.46 80.94,57.71 76.71,57.71 72.52,53.52
PB10: length 11.6
  Top Layer w0.254: U1.22 88.24,61.24 v1(88.14,61.14)
  POWER w0.254: v1(88.14,61.14) 88.39,61.14 90.93,63.68 H2.4
PB11: length 10.8
  Top Layer w0.254: H2.3 96.9,66.6 90.55,66.6 89.28,65.33 89.28,65.05 U1.25
PC13: length 12.9
  Top Layer w0.254: H3.2 74.55,53.01 76.38,53.01 76.4,53.03 81.87,53.03 82.97,54.13 U1.2
PC14-OSC32_IN: length 13.3
  Top Layer w0.254: U1.3 83.47,54.05 82.04,52.63 76.57,52.63 X2.1 75.43,48.74 C13.2
PC15-OSC32_OUT: length 11.5
  Top Layer w0.254: C14.2 77.74,48.64 X2.2 81.53,51.49 83.95,53.9 83.95,55.22 U1.4
PF0-OSC_IN: length 12.1
  Top Layer w0.254: U1.5 84.47,52.89 81.4,49.83 X1.1 81.41,48.81 C12.2
PF1-OSC_OUT: length 13.2
  Top Layer w0.254: U1.6 84.97,54.15 X1.2 89.79,48.31 C11.2
PG10-NRST: length 62.9
  Top Layer w0.254: U1.7 85.47,55.94 85.22,56.19 v1(85.22,57.07) ; v1(95.38,39.17) 95.38,38.29 R3.2 95.11,37.38 93.09,35.36 94.68,33.77 C10.2 93.48,32.31 REST.2
  POWER w0.254: 85.47,57.33 89.09,57.33 95.02,51.4 95.02,39.52 v1(95.38,39.17) ; 85.47,57.33 v1(85.22,57.07) ; 85.47,57.33 87.25,59.11 87.25,61.26 89.15,63.17 89.15,73.33 H4.1
SW1: length 69.6
  Top Layer w0.5: v1(57.91,76) 58.29,75.62 58.29,74.35 C38.1
  Top Layer w0.6: C38.1 58.31,73.56 U7.6
  Bottom Layer w0.5: v1(57.91,76) 57.78,75.87 53.47,75.87 46.61,69.01 28.45,69.01 v1(6.22,46.79)
  vias: v1(3.05,42.98) v1(3.17,44.12) v1(3.43,45.56) v1(3.81,41.71) v1(3.94,43.74) v1(4.5,45.56) v1(4.7,44.5) v1(7.24,41.07) v1(10.41,40.82) v1(10.79,47.17) v1(11.94,44.88) v1(12.95,45.9) v1(13.72,44.25) v1(13.72,41.96) v1(14.35,45.77)
SW2: length 69.1
  Top Layer w0.4: v1(14.73,31.8) 14.73,30.18 Q4.1 ; v1(58.04,62.56) 58.55,62.06 58.55,61.48 C39.1
  Top Layer w1: R20.1 9.14,32 U9.2
  Bottom Layer w0.4: v1(58.04,62.56) 47.91,62.56 47.62,62.28 47.62,59.99 46.61,58.98 46.61,56.18 45.59,55.17 41.53,55.17 31.62,45.26 23.88,45.26 22.48,43.87 22.48,39.55 v1(14.73,31.8)
  vias: v1(3.17,32.69) v1(3.43,35.74) v1(6.98,35.74) v1(11.43,35.61) v1(12.19,33.07)
VOUT+: length 49.2
  Top Layer w0.5: U16.8 68.21,27.24 v1(68.45,27.48)
  Top Layer w0.6: v1(68.45,27.48) 68.45,29.01 69.73,30.28 R34.1
  Bottom Layer w0.8: v1(33.65,18.97) 65.79,18.97 68.45,21.64 v1(68.45,27.48)
VOUT_FINAL: length 66.2
  Top Layer w0.5: U16.7 67.31,26.59 v1(67.44,26.47)
  Bottom Layer w0.8: v1(67.44,26.47) 67.44,22.28 65.53,20.37 16.51,20.37 15.49,19.35 15.49,14.78 v1(17.4,12.88)
XL4005E1_FB: length 26.2
  Top Layer w0.5: R11.2 41.77,32.81 v1(42.42,33.45) ; v1(46.36,48.44) 46.3,48.39 43.23,48.39 43.05,48.56 43.05,50.7 U6.2
  Bottom Layer w0.5: v1(46.36,48.44) 47.47,47.32 47.47,36.22 47.12,35.86 44.83,35.86 v1(42.42,33.45)
$1N8: length 4.3
  Top Layer w0.6: 18.78,93.69 18.86,93.61 18.86,92.95 19.05,92.76 19.05,91.87 ; 14.35,91.49 13.98,91.86 USB2.11
$1N11: length 5
  Top Layer w0.6: R6.1 4.6,86.55 R5.2 5.79,86.61 6.48,87.3 Q1.4
$1N18: length 8.8
  Top Layer w0.6: R7.2 9.86,91.11 v1(8.76,91.11) ; U4.8 v1(3.81,89.57)
  Bottom Layer w0.6: v1(3.81,89.57) 3.81,90.6 4.32,91.11 v1(8.76,91.11)
$1N27: length 5.6
  Top Layer w0.6: U4.1 5.81,97.68 6.03,97.9 C16.1 9.28,97.9 R10.1
$1N38: length 4.8
  Top Layer w0.6: R8.2 6.7,91.98 5.32,91.98 4.81,91.47 U4.9
$1N43: length 17.5
  Top Layer w0.8: D2.1 43,75.17 32.19,75.17 30.94,73.92 U5.2
$1N50: length 11.3
  Top Layer w0.6: U6.3 41.15,48.31 42.04,47.42 45.87,47.42 D4.2
$1N72: length 4.1
  Top Layer w0.4: R17.2 3.02,54.12 Q3.4
  Top Layer w0.6: R15.2 4.56,54.15 R17.2
$1N81: length 5.4
  Top Layer w0.4: Q4.4 10.16,29.38 10.16,27.86 9.98,27.68 9.2,27.68 R20.2
  Top Layer w0.5: 9.13,27.76 R21.1
$1N89: length 6.9
  Top Layer w0.6: U7.7 55.98,72.29 U10.1
$1N90: length 12.6
  Top Layer w0.5: U11.1 54.84,74.74 53.52,76.06 R26.1
  Top Layer w0.6: U7.5 61.21,74.85 60.07,74.85 59.31,75.62 59.31,77.01 58.88,77.44 57.83,77.44 U11.1
$1N97: length 11.6
  Top Layer w0.6: U8.5 58.57,64 R28.1 54.71,62.68 U13.1
$1N100: length 6.3
  Top Layer w0.6: D7.1 58.68,57.26 C39.2 60.91,57.85 U8.8
$1N101: length 3.1
  Top Layer w0.6: R24.1 65.67,54.67 D7.2
$1N105: length 9.7
  Top Layer w0.6: U8.7 56.26,59.11 55.19,58.03 U12.1 53.65,56.84 R27.1
$1N139: length 3.6
  Top Layer w0.5: U15.2 82.55,26.98 R30.2 82.56,25.61 R33.2
$1N140: length 4.1
  Top Layer w0.5: R32.2 82.58,30.38 R31.2 82.31,28.25 U15.3
$1N144: length 3.8
  Top Layer w0.5: R33.1 82.26,23.79 R38.1 80.77,25.43 U15.1
$1N147: length 3.7
  Top Layer w0.5: R35.2 73.65,31.8 R36.2 74.95,30.5 U15.5
$1N149: length 4
  Top Layer w0.6: R34.2 R37.2 74.57,28.63 U15.6
$1N150: length 5.8
  Top Layer w0.5: R37.1 71.25,27.01 R39.1 74.8,26.83 U15.7
$2N73: length 13.3
  Top Layer w0.6: D8.2 83.78,92.22 88.49,92.22 88.65,92.38 ; 88.65,92.38 89.03,92 92.71,92 93.53,92.82 93.53,93.69 ; 88.65,92.38 88.66,92.39 USB1.11

## Copper pours and planes (outline as drawn; the poured copper is in the pictures)
GND on Top Layer: 23.85,48.89 34.62,49.2 35.05,49.2 35.05,46.02 24.51,46.02 24.13,45.64 24.13,48.61
GND on Top Layer: 28.5,85.95 28.5,98.85 99.31,98.78 99.31,0.56 36.26,0.3 36.11,5.92 37.08,6.89 37.08,19.35 34.92,21.51 21.08,21.51 22.86,23.29 22.86,47.42 19.81,50.47 19.81,54.53 14.05,54.53 12.57,56.01 12.57,66.09 13.72,67.23 30.61,67.23 30.61,73.58 28.96,75.23 27.81,75.23 27.69,75.36 27.69,78.79 25.65,78.79 24.64,79.81 17.4,79.81 17.27,79.68 17.27,79.81 13.97,83.11 17.65,83.11 17.78,82.98 26.8,82.98 26.8,84.25
GND on Bottom Layer: 36.05,6.4 37.02,7.37 37.02,19.83 34.86,21.99 21.02,21.99 22.8,23.77 22.8,47.9 19.75,50.95 19.75,55.01 13.98,55.01 12.51,56.49 12.51,66.57 13.65,67.71 30.54,67.71 30.54,74.06 28.89,75.71 27.75,75.71 27.62,75.84 27.62,79.27 25.59,79.27 24.57,80.28 17.34,80.28 17.21,80.16 17.21,80.28 13.91,83.59 17.59,83.59 17.72,83.46 26.73,83.46 26.73,84.73 28.43,86.43 28.43,99.33 99.19,99.25 99.19,1.07 36.13,0.81 36.13,6.31
GND on GND: 0.26,99.74 99.74,99.74 99.74,0.26 0.26,0.26
PGND on Top Layer: 0.25,85.01 3.17,85.01 3.3,84.89 3.3,82.27 4.51,82.27 4.83,81.95 4.96,81.95 5.33,81.58 5.33,63.8 3,61.47 3,55.51 2.92,55.42 1.92,55.42 1.92,53.79 1.9,53.77 1.27,53.77 1.2,53.84 1.2,53.77 1.13,53.77 0.63,53.27 0.38,53.27 0.38,84.89
PGND on Top Layer: 2.29,52.83 5.26,52.83 5.33,52.76 5.33,51.23 1.4,51.23 2.16,51.99 2.16,52.25 2.29,52.38
PGND on Top Layer: 0.51,25.45 4.32,25.45 4.44,25.32 4.44,22.28 4.47,22.3 4.47,22.25 7.01,19.71 7.26,19.71 7.49,19.48 7.49,5.26 9.02,3.73 10.16,3.73 13.33,6.91 14.99,6.91 15.11,6.78 19.94,6.78 20.07,6.66 21.21,6.66 21.72,7.16 21.72,7.8 23.28,9.36 28.41,9.36 28.45,9.32 35.05,9.32 35.05,1 25.85,1 25.78,1.07 0.62,1.07 0.62,25.34
PGND on Bottom Layer: 10.5,84.92 10.79,84.63 10.79,55.3 10.67,55.17 11.81,54.03 11.81,53.52 16.76,53.52 17.14,53.14 17.14,20.12 17.4,19.86 34.04,19.86 35.31,18.59 35.31,1.32 34.8,0.81 0.76,0.81 0.38,1.19 0.38,84.92
VBUS on Top Layer: 7.49,89.84 7.62,89.97 11.05,89.97 11.68,90.6 15.88,90.6 15.88,86.78 15.75,86.65 15.69,86.72 11.58,86.72 10.99,87.3 7.5,87.3 7.49,87.3
VBUS on Top Layer: 9.27,92.4 9.27,96.08 10.8,96.08 10.8,92.77 10.43,92.4
VCC5 on Top Layer: 61.34,27.74 63.02,27.74 63.88,27.41 63.88,26.37 62.74,26.37 62.14,26.97 61.34,26.97 61.34,26.98
VCC5 on Top Layer: 53.59,27.86 55.52,27.86 55.97,27.41 55.97,26.29 55.04,26.29 54.29,27.04 53.7,27.04 53.64,27.1 53.59,27.1
VCC5 on Top Layer: 81.53,79.43 81.41,79.43 81.41,79.3 80.78,78.66 78.99,78.66 78.58,79.08 78.58,80.57 79.37,80.57 79.37,79.3 79.5,79.17 80.26,79.17 80.44,79.35 80.44,80.57 80.52,80.57 80.52,81.51 80.06,81.98 80.06,82.78 80.14,82.85 80.14,85.39 80.39,85.65 84.71,85.65 84.84,85.52 84.84,83.24 84.96,83.11 84.58,82.73 84.58,82.85 81.79,82.85 81.66,82.73 81.66,79.55
VCC12 on Top Layer: 65.66,55.55 65.66,58.09 65.4,58.34 69.35,58.34 69.67,58.03 69.67,56.38 69.6,56.31 67.44,56.31 67.44,55.55 67.31,55.42 67.18,55.55
VCC12 on Top Layer: 65.81,68.45 65.81,71.15 65.66,71.3 67.63,71.3 67.63,70.47 68.07,70.03 69.72,70.03 69.98,69.77 69.98,68.34 69.92,68.4 65.86,68.4
VCC12 on Top Layer: 39.88,53.14 39.88,52.76 40.01,52.76 40.01,48.95 37.34,48.95 36.58,49.71 33.15,49.71 33.02,49.83 26.55,49.83 26.55,55.3 28.96,57.71 34.54,57.71 37.21,55.04 37.21,60.15 37.77,60.71 44.5,60.71 45.21,59.99 45.21,57.2 43.81,55.8 42.55,55.8
VCC20 on Top Layer: 10.05,79.26 12.45,79.26 12.45,69.39 12.83,69.01 10.03,69.01 9.91,69.14 9.91,79.12
VCC20 on Top Layer: 11.43,79.04 10.67,79.04 10.67,66.73 10.79,66.6 10.79,57.33 10.54,57.07 10.54,55.04 7.27,55.04 6.77,55.54 3.49,55.54 3.49,61.11 5.84,63.46 5.84,81.58 4.47,82.95 3.78,82.95 3.68,82.85 3.68,83.8 6.03,83.8 6.48,84.25 10.36,84.25 10.67,83.95 10.67,83.87 15.37,79.17 15.37,79.04 16.13,78.28 26.16,78.28 26.16,75.11 27.3,73.96 28.57,73.96 29.84,72.69 29.84,69.1 29.76,69.01 12.19,69.01 11.43,69.77
VCC20 on Bottom Layer: 4.51,82.9 3.76,82.9 3.68,82.98 3.68,83.87 6.1,83.87 6.48,84.25 10.41,84.25 10.54,84.12 10.54,57.58 10.79,57.33 10.54,57.07 10.54,55.17 10.41,55.04 7.37,55.04 6.73,55.68 3.81,55.68 3.68,55.55 3.68,61.01 3.56,61.14 5.87,63.45 5.87,81.49 4.51,82.85 4.51,82.9
VCC20_PWR on Top Layer: 7.24,49.07 7.24,52.63 7.37,52.76 16.76,52.76 16.89,52.88 17.78,52.88 18.16,52.5 17.78,52.12 17.78,48.56 7.75,48.56
VCC20_PWR on Top Layer: 7.24,49.07 7.24,50.98 11.56,50.98 11.68,51.1 11.68,53.01 12.06,53.39 16.89,53.39 17.02,53.26 17.02,48.69 16.89,48.56 7.37,48.56 7.11,48.82 7.11,48.95
VCC33 on Top Layer: 80.16,78.1 80.36,78.29 81.14,78.29 81.28,78.16 81.28,75.47 80.16,75.47
VCC33 on Top Layer: 91.68,62.31 94.2,62.31 94.36,62.15 94.36,59.99 94.49,59.87 91.82,59.87 91.69,59.74 91.69,62.3
VIN- on Top Layer: 0,100 26.16,100 26.54,99.62 26.54,86.51 25.6,85.56 0.08,85.56 0,85.65 0,99.75 -0.13,99.87 0,99.87
VIN- on Bottom Layer: 0,100 26.42,100 26.42,85.52 0,85.52
MOS_PWM_H1 on Top Layer: 49.53,72.06 51.43,72.06 51.56,71.93 51.56,70.03 52.7,70.03 52.83,69.9 52.64,69.71 52.64,67.99 49.79,67.99 49.4,68.38 49.4,71.93
PB8-BOOT0 on Top Layer: 70.48,77.9 71.88,77.9 72.01,77.77 72.01,76.38 73.05,75.34 73.05,73.95 72.1,73.95 72.1,74.69 72.14,74.73 70.48,76.38
SW1 on Top Layer: 1.02,50.47 0.97,50.52 0.97,50.73 5.17,50.73 5.83,50.06 5.83,47.64 15.15,47.64 15.37,47.42 15.37,46.12 16.28,46.12 16.51,45.9 16.51,42.53 1.08,42.53 1.02,42.47
SW1 on Top Layer: 1.08,42.53 1.9,43.36 16.51,43.36 16.51,40.18 15.88,39.55 1.4,39.55 1.4,42.21
SW1 on Bottom Layer: 2,50.7 5.49,50.7 5.71,50.47 5.71,47.56 15.24,47.56 15.24,46.15 15.37,46.02 16.38,46.02 16.38,40.18 15.89,39.69 2.18,39.75 2.18,42.72 2.16,42.72 2.16,49.33
SW2 on Top Layer: 5.38,26.33 0.97,26.33 0.97,34.85 10.67,34.85 10.79,34.72 10.79,31.04 9.98,31.04 9.98,30.53 5.38,30.53
SW2 on Top Layer: 57.24,60.39 57.24,61.73 57.34,61.77 58.76,61.74 59.99,60.68 61.8,60.68 61.98,60.5 61.85,60.38 61.85,60.12 60.45,60.12 60.33,59.99 59.31,59.99 58.93,60.38 57.4,60.38 57.28,60.25 57.28,60.35
SW2 on Top Layer: 11.96,30.62 5.75,30.62 5.71,30.66 5.71,34.82 15.37,34.82 15.37,29.64 11.96,29.64
SW2 on Top Layer: 1.02,34.09 0.89,34.21 0.89,36.88 15.37,36.83 15.37,33.71 14.99,34.09
SW2 on Bottom Layer: 2.54,36.88 15.24,36.88 15.37,36.75 15.37,29.9 15.11,29.64 12.01,29.64 12.01,30.59 11.94,30.66 11.45,30.66 11.28,30.83 10.46,30.83 10.41,30.78 10.41,30.66 9.78,30.66 9.65,30.53 9.65,29.88 8.48,29.88 8.64,30.04 8.64,30.53 5.53,30.53 5.53,26.54 5.33,26.34 2.54,26.34
VOUT+ on Top Layer: 17.4,15.93 17.4,19.68 21.52,19.68 21.59,19.61 33.91,19.61 34.67,18.85 34.67,9.83 22.73,9.83 22.1,10.47 22.1,15.82 17.5,15.82
VOUT+ on Bottom Layer: 22.1,15.93 17.5,15.93 17.4,16.03 17.4,19.35 17.65,19.61 34.04,19.61 34.67,18.97 34.67,10.34 34.29,9.96 23.11,9.96 22.86,9.7 22.86,9.83 22.22,10.47 22.22,15.8
VOUT_FINAL on Top Layer: 10.64,28.49 15.05,28.49 15.05,21.7 13.33,19.99 13.33,11.1 13.08,10.85 14.73,10.85 18.16,14.27 21.46,14.27 21.46,7.69 21.11,7.33 13.93,7.33 13.67,7.59 13,7.59 10.41,5 8.76,5 8.51,5.26 8.51,21.13 10.64,23.26
VOUT_FINAL on Bottom Layer: 8.76,21.13 8.76,21.39 10.54,23.16 10.54,27.61 10.67,27.74 10.83,27.57 15.05,27.57 15.05,21.96 13.21,20.12 13.21,10.85 14.99,10.85 18.16,14.02 18.16,14.15 21.34,14.15 21.34,7.67 21.2,7.54 12.69,7.54 10.29,5.13 8.64,5.13 8.64,21.01
XL4005E1_FB on Top Layer: 37.03,32.45 36.96,32.53 36.96,33.32 37.07,33.44 41.61,33.44 41.61,32.46 41.6,32.45
$1N8 on Top Layer: 17.91,86.79 17.99,90.86 14.22,90.86 13.49,91.5 13.49,92.25 21.48,92.25 22.22,91.51 22.22,86.79
$1N43 on Top Layer: 30.35,72.69 31.5,72.69 31.5,69.52 31.37,69.39 31.62,69.14 31.62,68.21 34.29,68.21 34.29,65.34 28.96,65.34 28.96,68.22 30.03,68.22 30.03,68.94 30.35,69.27
$1N50 on Top Layer: 49.28,43.99 46.36,43.99 46.36,36.75 46.48,36.63 36.32,36.63 36.07,36.37 36.07,39.67 35.56,40.18 24.77,40.18 24.38,40.57 24.38,42.85 24.18,43.05 27,43.05 27.3,43.36 34.16,43.36 34.42,43.1 34.42,44.12 35.69,45.39 46.23,45.39 46.29,45.33 46.32,45.35 47.14,45.35 47.54,45.75 47.61,45.68 49.18,45.68 49.28,45.77
$1N59 on Top Layer: 32.51,25.45 32.51,25.58 26.69,25.58 25.53,26.73 22.97,26.73 22.75,26.96 22.75,27.67 26.11,31.04 27.56,31.04 27.56,34.09 27.69,34.21 31.11,34.21 31.37,33.96 31.37,29.9 32.51,28.75 32.51,27.86 38.35,27.86 38.73,27.48 38.73,24.31 38.35,23.93 34.42,23.93 33.53,24.82 33.15,24.82
$1N59 on Top Layer: 36.96,31.67 39.82,31.67 39.82,30.97 39.88,30.91 38.48,29.51 38.48,26.97 37.08,26.97 36.96,27.1
$1N71 on Top Layer: 15.81,47.68 16.77,47.68 16.77,47.17 17.4,46.53 17.4,45.9 19.94,45.9 20.07,45.77 20.07,44.51 17.01,44.51 16.89,44.63 16.89,45.96 16.45,46.41 15.81,46.41
$1N71 on Top Layer: 15.88,47.68 18.03,47.68 18.16,47.55 18.16,45.77 18.03,45.64 17.14,45.64 17.02,45.77 17.02,46.53
$1N76 on Top Layer: 4.79,22.89 4.79,25.29 4.83,25.32 5.66,25.32 5.66,24.36 5.71,24.31 7.75,24.31 7.87,24.18 7.87,23.18 7.54,22.84 4.84,22.84
$1N86 on Top Layer: 63.12,69.27 63.25,69.14 65.15,69.14 65.15,68 65.28,67.87 67.06,67.87 67.31,67.61 67.31,66.34 67.18,66.22 65.66,66.22 65.53,66.34 65.53,67.27 63.46,67.27 63.12,67.61
$1N87 on Top Layer: 57.04,71.44 62.1,71.44 62.1,70.79 62.23,70.66 62.17,70.6 62.17,70.02 60.58,70.02 60.58,67.41 60.53,67.36 58.04,67.36 58.17,67.49 58.17,69.14 57.4,69.14 57.02,69.52 57.04,69.53
$1N89 on Top Layer: 53.33,68.17 53.33,69.84 53.52,70.03 53.73,70.03 53.85,70.15 53.85,72.19 55.88,72.19 55.98,72.29 55.98,70.13 55.5,69.65 55.5,68.12 53.37,68.12

Small or netless copper shapes (teardrops, artwork), in the pictures only: 1 on Top Layer, 40 on GND

## Text on the board
Top Silkscreen Layer: PB9 | PC13 | PB6 | PB7 | PA12 | PA15 | PB3 | PB5 | PB4 | PA5 | PA6 | PA7 | PB0 | PB11 | PA8 | PA11 | PB10 | PB2 | PB1 | 无 | 供电 | 转串口 | 下载电路
